# Altium schematic sheet EVB-ANNA-B5_SCHEM_0002_ANNA_Module.SchDoc: UBX_NORA_B1_SCHEM_0001_NORA_B1_Module
size A3; Date: 7/24/2020; CompanyName: U-blox; DrawnBy: EMOO; Engineer: EMOO; Organization: U-blox; Address1: 3950 Fairview Industrial Dr SE #100; Address2: Salem, OR 97302; DocumentNumber: 3; SheetNumber: 3; SheetTotal: 8; Website: www.u-blox.com; SheetSize: B
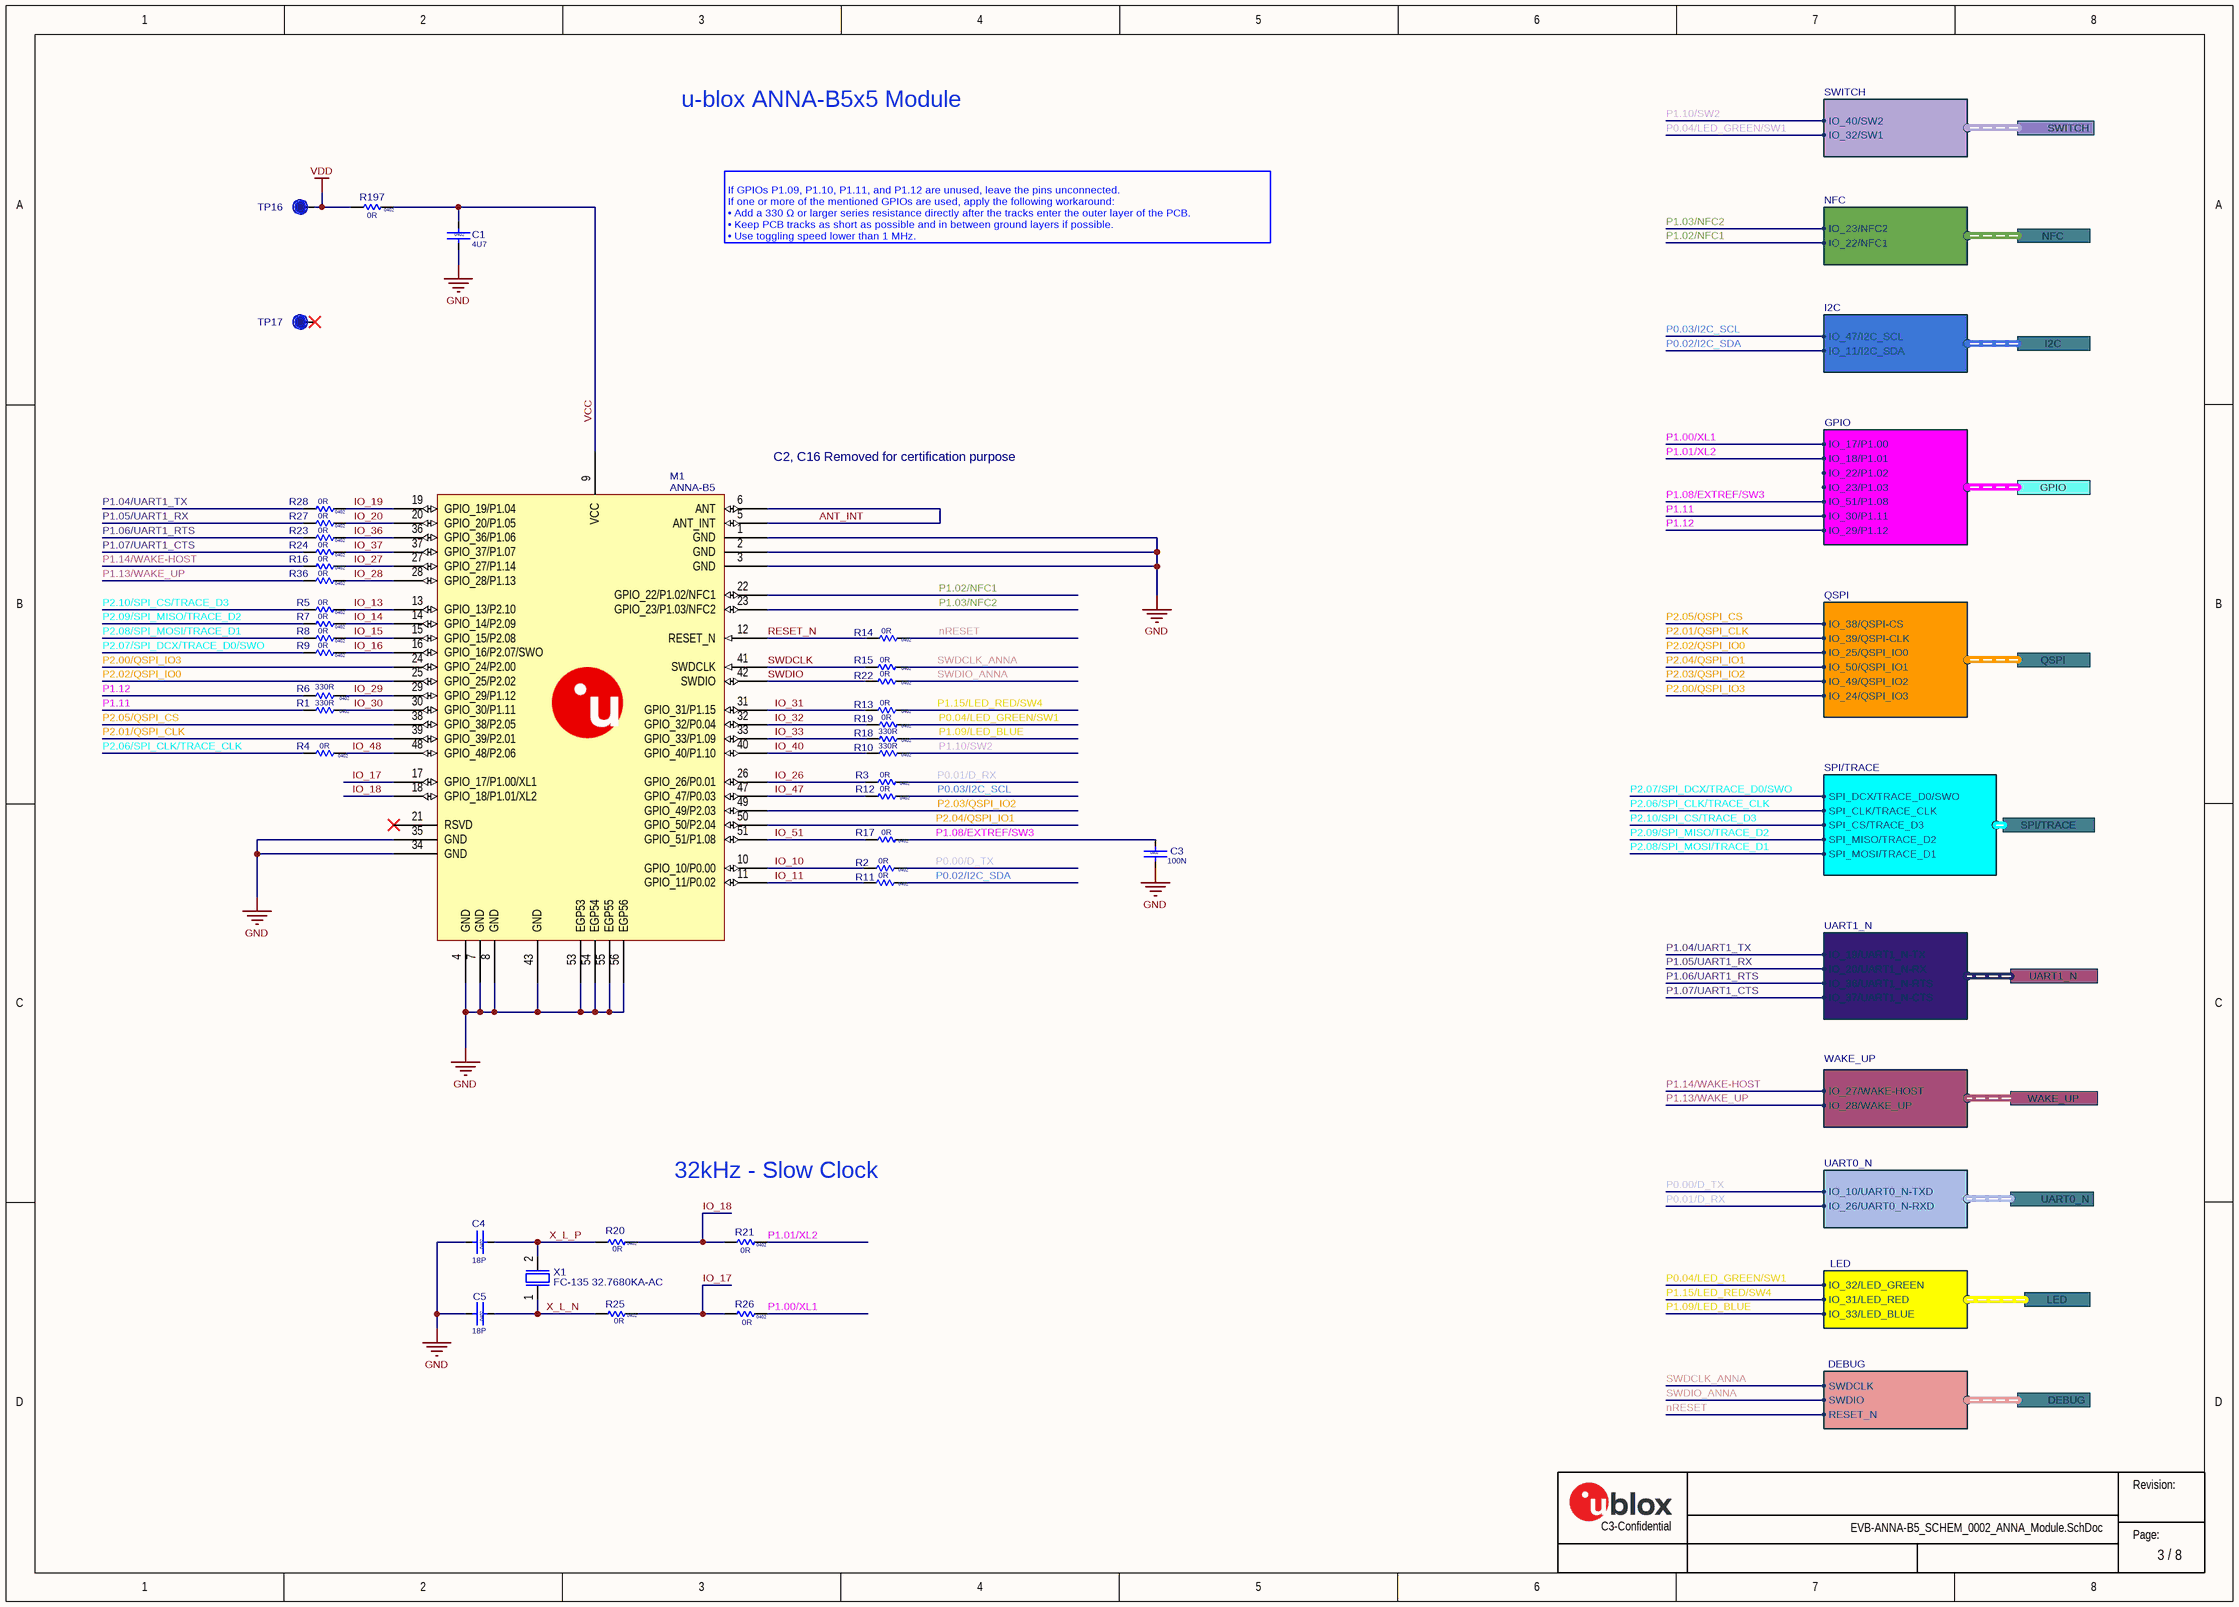
[diagram p0: EVB-ANNA-B5_SCHEM_0002_ANNA_Module.SchDoc]

## Parts
C1  value 4U7  Size: 0402  [Cap 0402 HD]  (hidden comment: UBXH01-0000243)
C3  value 100N  Size: 0402  [Cap 0402 HD]  (hidden comment: UBXH01-2021002)
C4  value 18P  Size: 0402  [Cap_0402_1100Lx600Wx600H_600x600Pad_350G_FLX]  (hidden comment: UBXH01-0004017)
C5  value 18P  Size: 0402  [Cap_0402_1100Lx600Wx600H_600x600Pad_350G_FLX]  (hidden comment: UBXH01-0004017)
M1  UBXH29-0000036  [ANNA-B5]  (value not drawn)
R1  value 330R  Size: 0402  [RES_0402_1100Lx600Wx400H_500x600Pad_400G_FLX]  (hidden comment: UBXH18-0008037)
R2  value 0R  Size: 0402  [RES 0402 HD]  (hidden comment: UBXH18-0003002)
R3  value 0R  Size: 0402  [RES 0402 HD]  (hidden comment: UBXH18-0003002)
R4  value 0R  Size: 0402  [RES 0402 HD]  (hidden comment: UBXH18-0003002)
R5  value 0R  Size: 0402  [RES 0402 HD]  (hidden comment: UBXH18-0003002)
R6  value 330R  Size: 0402  [RES_0402_1100Lx600Wx400H_500x600Pad_400G_FLX]  (hidden comment: UBXH18-0008037)
R7  value 0R  Size: 0402  [RES 0402 HD]  (hidden comment: UBXH18-0003002)
R8  value 0R  Size: 0402  [RES 0402 HD]  (hidden comment: UBXH18-0003002)
R9  value 0R  Size: 0402  [RES 0402 HD]  (hidden comment: UBXH18-0003002)
R10  value 330R  Size: 0402  [RES_0402_1100Lx600Wx400H_500x600Pad_400G_FLX]  (hidden comment: UBXH18-0008037)
R11  value 0R  Size: 0402  [RES 0402 HD]  (hidden comment: UBXH18-0003002)
R12  value 0R  Size: 0402  [RES_0402_1100Lx600Wx400H_500x600Pad_400G_FLX]  (hidden comment: UBXH18-0003002)
R13  value 0R  Size: 0402  [RES_0402_1100Lx600Wx400H_500x600Pad_400G_FLX]  (hidden comment: UBXH18-0003002)
R14  value 0R  Size: 0402  [RES_0402_1100Lx600Wx400H_500x600Pad_400G_FLX]  (hidden comment: UBXH18-0003002)
R15  value 0R  Size: 0402  [RES 0402 HD]  (hidden comment: UBXH18-0003002)
R16  value 0R  Size: 0402  [RES 0402 HD]  (hidden comment: UBXH18-0003002)
R17  value 0R  Size: 0402  [RES 0402 HD]  (hidden comment: UBXH18-0003002)
R18  value 330R  Size: 0402  [RES_0402_1100Lx600Wx400H_500x600Pad_400G_FLX]  (hidden comment: UBXH18-0008037)
R19  value 0R  Size: 0402  [RES 0402 HD]  (hidden comment: UBXH18-0003002)
R20  value 0R  Size: 0402  [RES 0402 HD]  (hidden comment: UBXH18-0003002)
R21  value 0R  Size: 0402  [RES_0402_1100Lx600Wx400H_500x600Pad_400G_FLX]  (hidden comment: UBXH18-0003002)
R22  value 0R  Size: 0402  [RES 0402 HD]  (hidden comment: UBXH18-0003002)
R23  value 0R  Size: 0402  [RES 0402 HD]  (hidden comment: UBXH18-0003002)
R24  value 0R  Size: 0402  [RES 0402 HD]  (hidden comment: UBXH18-0003002)
R25  value 0R  Size: 0402  [RES 0402 HD]  (hidden comment: UBXH18-0003002)
R26  value 0R  Size: 0402  [RES_0402_1100Lx600Wx400H_500x600Pad_400G_FLX]  (hidden comment: UBXH18-0003002)
R27  value 0R  Size: 0402  [RES 0402 HD]  (hidden comment: UBXH18-0003002)
R28  value 0R  Size: 0402  [RES 0402 HD]  (hidden comment: UBXH18-0003002)
R36  value 0R  Size: 0402  [RES_0402_1100Lx600Wx400H_500x600Pad_400G_FLX]  (hidden comment: UBXH18-0003002)
R197  value 0R  Size: 0402  [RES 0402 HD]  (hidden comment: UBXH18-0003002)
TP16  TP10R  [TP10R]  (value not drawn)  (no BOM)
TP17  TP10R  [TP10R]  (value not drawn)  (no BOM)
X1  Manufacturer P/N: FC-135 32.7680KA-AC  [XTAL_3215]  (hidden comment: UBXH21-0008104)

## Ports
DEBUG (harness Debug), GPIO (harness GPIO), I2C (harness I2C), LED (harness LED), NFC (harness NFC), QSPI (harness QSPI), SPI/TRACE (harness SPI/TRACE), SWITCH (harness SWITCH), UART0_N (harness UART0_N), UART1_N (harness UART1_N), WAKE_UP (harness WAKE_UP)

## Harnesses
DEBUG: RESET_N, SWDIO, SWDCLK
UART1_N: IO_36/UART1_N-RTS, IO_37/UART1_N-CTS, IO_19/UART1_N-TX, IO_20/UART1_N-RX
QSPI: IO_38/QSPI-CS, IO_39/QSPI-CLK, IO_25/QSPI_IO0, IO_50/QSPI_IO1, IO_49/QSPI_IO2, IO_24/QSPI_IO3
LED: IO_33/LED_BLUE, IO_31/LED_RED, IO_32/LED_GREEN
I2C: IO_47/I2C_SCL, IO_11/I2C_SDA
NFC: IO_23/NFC2, IO_22/NFC1
SWITCH: IO_40/SW2, IO_32/SW1
GPIO: IO_17/P1.00, IO_18/P1.01, IO_22/P1.02, IO_51/P1.08, IO_23/P1.03, IO_30/P1.11, IO_29/P1.12
UART0_N: IO_10/UART0_N-TXD, IO_26/UART0_N-RXD
WAKE_UP: IO_27/WAKE-HOST, IO_28/WAKE_UP
SPI/TRACE: SPI_DCX/TRACE_D0/SWO, SPI_CLK/TRACE_CLK, SPI_CS/TRACE_D3, SPI_MISO/TRACE_D2, SPI_MOSI/TRACE_D1

## Nets
GND: C1.2 C3.1 C4.2 C5.2 M1.1(GND) M1.2(GND) M1.3(GND) M1.4(GND) M1.7(GND) M1.8(GND) M1.34(GND) M1.35(GND) M1.43(GND) M1.53(EGP53) M1.54(EGP54) M1.55(EGP55) M1.56(EGP56)
VDD: R197.2 TP16.1
ANT_INT: M1.5(ANT_INT) M1.6(ANT)
IO_10: M1.10(GPIO_10/P0.00) R2.2
IO_11: M1.11(GPIO_11/P0.02) R11.1
IO_13: M1.13(GPIO_13/P2.10) R5.2
IO_14: M1.14(GPIO_14/P2.09) R7.2
IO_15: M1.15(GPIO_15/P2.08) R8.2
IO_16: M1.16(GPIO_16/P2.07/SWO) R9.2
IO_17: M1.17(GPIO_17/P1.00/XL1) R25.2 R26.2
IO_18: M1.18(GPIO_18/P1.01/XL2) R20.2 R21.2
IO_19: M1.19(GPIO_19/P1.04) R28.1
IO_20: M1.20(GPIO_20/P1.05) R27.1
IO_26: M1.26(GPIO_26/P0.01) R3.2
IO_27: M1.27(GPIO_27/P1.14) R16.2
IO_28: M1.28(GPIO_28/P1.13) R36.1
IO_29: M1.29(GPIO_29/P1.12) R6.2
IO_30: M1.30(GPIO_30/P1.11) R1.2
IO_31: M1.31(GPIO_31/P1.15) R13.1
IO_32: M1.32(GPIO_32/P0.04) R19.1
IO_33: M1.33(GPIO_33/P1.09) R18.2
IO_36: M1.36(GPIO_36/P1.06) R23.2
IO_37: M1.37(GPIO_37/P1.07) R24.2
IO_40: M1.40(GPIO_40/P1.10) R10.2
IO_47: M1.47(GPIO_47/P0.03) R12.1
IO_48: M1.48(GPIO_48/P2.06) R4.2
IO_51: M1.51(GPIO_51/P1.08) R17.2
nRESET: R14.2 ; port DEBUG.RESET_N
P0.00/D_TX: R2.1 ; port UART0_N.IO_10/UART0_N-TXD
P0.01/D_RX: R3.1 ; port UART0_N.IO_26/UART0_N-RXD
P0.02/I2C_SDA: R11.2 ; port I2C.IO_11/I2C_SDA
P0.03/I2C_SCL: R12.2 ; port I2C.IO_47/I2C_SCL
P0.04/LED_GREEN/SW1: R19.2 ; port LED.IO_32/LED_GREEN, port SWITCH.IO_32/SW1
P1.00/XL1: R26.1 ; port GPIO.IO_17/P1.00
P1.01/XL2: R21.1 ; port GPIO.IO_18/P1.01
P1.02/NFC1: M1.22(GPIO_22/P1.02/NFC1) ; port NFC.IO_22/NFC1
P1.03/NFC2: M1.23(GPIO_23/P1.03/NFC2) ; port NFC.IO_23/NFC2
P1.04/UART1_TX: R28.2 ; port UART1_N.IO_19/UART1_N-TX
P1.05/UART1_RX: R27.2 ; port UART1_N.IO_20/UART1_N-RX
P1.06/UART1_RTS: R23.1 ; port UART1_N.IO_36/UART1_N-RTS
P1.07/UART1_CTS: R24.1 ; port UART1_N.IO_37/UART1_N-CTS
P1.08/EXTREF/SW3: C3.2 R17.1 ; port GPIO.IO_51/P1.08
P1.09/LED_BLUE: R18.1 ; port LED.IO_33/LED_BLUE
P1.10/SW2: R10.1 ; port SWITCH.IO_40/SW2
P1.11: R1.1 ; port GPIO.IO_30/P1.11
P1.12: R6.1 ; port GPIO.IO_29/P1.12
P1.13/WAKE_UP: R36.2 ; port WAKE_UP.IO_28/WAKE_UP
P1.14/WAKE-HOST: R16.1 ; port WAKE_UP.IO_27/WAKE-HOST
P1.15/LED_RED/SW4: R13.2 ; port LED.IO_31/LED_RED
P2.00/QSPI_IO3: M1.24(GPIO_24/P2.00) ; port QSPI.IO_24/QSPI_IO3
P2.01/QSPI_CLK: M1.39(GPIO_39/P2.01) ; port QSPI.IO_39/QSPI-CLK
P2.02/QSPI_IO0: M1.25(GPIO_25/P2.02) ; port QSPI.IO_25/QSPI_IO0
P2.03/QSPI_IO2: M1.49(GPIO_49/P2.03) ; port QSPI.IO_49/QSPI_IO2
P2.04/QSPI_IO1: M1.50(GPIO_50/P2.04) ; port QSPI.IO_50/QSPI_IO1
P2.05/QSPI_CS: M1.38(GPIO_38/P2.05) ; port QSPI.IO_38/QSPI-CS
P2.06/SPI_CLK/TRACE_CLK: R4.1 ; port SPI/TRACE.SPI_CLK/TRACE_CLK
P2.07/SPI_DCX/TRACE_D0/SWO: R9.1 ; port SPI/TRACE.SPI_DCX/TRACE_D0/SWO
P2.08/SPI_MOSI/TRACE_D1: R8.1 ; port SPI/TRACE.SPI_MOSI/TRACE_D1
P2.09/SPI_MISO/TRACE_D2: R7.1 ; port SPI/TRACE.SPI_MISO/TRACE_D2
P2.10/SPI_CS/TRACE_D3: R5.1 ; port SPI/TRACE.SPI_CS/TRACE_D3
RESET_N: M1.12(RESET_N) R14.1
SWDCLK: M1.41(SWDCLK) R15.1
SWDCLK_ANNA: R15.2 ; port DEBUG.SWDCLK
SWDIO: M1.42(SWDIO) R22.1
SWDIO_ANNA: R22.2 ; port DEBUG.SWDIO
VCC: C1.1 M1.9(VCC) R197.1
X_L_N: C5.1 R25.1 X1.1
X_L_P: C4.1 R20.1 X1.2

Not connected (* = marked no-connect by the designer): M1 21(RSVD)*; TP17 1*

## Notes on the sheet
- u-blox ANNA-B5x5 Module
- If GPIOs P1.09, P1.10, P1.11, and P1.12 are unused, leave the pins unconnected.
  If one or more of the mentioned GPIOs are used, apply the following workaround:
  • Add a 330 Ω or larger series resistance directly after the tracks enter the outer layer of the PCB.
  • Keep PCB tracks as short as possible and in between ground layers if possible.
  • Use toggling speed lower than 1 MHz.
- (near M1) C2, C16 Removed for certification purpose
- 32kHz - Slow Clock
- Revision:
- C3-Confidential
- Page:

## Library data of the parts
C1 = UBXH01-0000243: CAP CER X5R 0402 4U7 20% 10V; Manufacturer: Murata Manufacturing Company, Ltd.; Manufacturer P/N: GRM155R61A475MEAA; Editor: martin.pilik; Released by: fabrice.bret-dibat; Env: GREEN; Permitted Use: Volume Products; Perferred: PREF; Mfg P/N Status: Active; Mfg P/N Split: 100; Mfg P/N Released: Yes; Part Number: UBXH01-0000243; Tolerance: 20%; Max Voltage: 10V; Min Operating Temp: -40°C; Max Operating Temp: 85°C; Part Type: Capacitor; Release Data: 2021-05-10 12:57:47.325652; UBX Wiki: https://wiki.u-blox.com/bin/view/Operations/PartDetails?index=24303; RefDes: C; Mfg P/N Datasheet: https://wiki.u-blox.com/bin/view/Generic/Docs/DocumentSummary?index=24302
C3 = UBXH01-2021002: CAP CER X5R 0402 100N 10% 10V; Manufacturer: Murata Manufacturing Company, Ltd.; Manufacturer P/N: GRM155R61A104KA01; Editor: roland.rust; Env: GREEN; Permitted Use: Volume Products; Perferred: PREF; Mfg P/N Status: NRND; Mfg P/N Split: 100; Mfg P/N Released: Yes; Part Number: UBXH01-2021002; Tolerance: 10%; Max Voltage: 10V; Part Type: Capacitor; Released by: roland.rust; Release Data: 2005-07-22T13:59:44; UBX Wiki: https://wiki.u-blox.com/bin/view/Operations/PartDetails?index=5759; RefDes: C; Manufacturer 2: Samsung Electro-Mechanics; Manufacturer P/N 2: CL05A104KP5NNN; Mfg P/N Status 2: Active; Mfg P/N Split 2: 0; Mfg P/N Released 2: Yes; Mfg P/N Datasheet 2: https://wiki.u-blox.com/bin/view/Generic/Docs/DocumentSummary?index=28113
C4 C5 = UBXH01-0004017: CAP CER C0G 0402 18P 5% 25V; Manufacturer: Murata Manufacturing Company, Ltd.; Manufacturer P/N: GRM1555C1H180JA01; Editor: doris.zahnd; Env: ROHS; Permitted Use: Volume Products; Perferred: PREF; Mfg P/N Status: NRND; Mfg P/N Split: 100; Mfg P/N Released: Yes; Released by: daniel.hurni; Part Number: UBXH01-0004017; Tolerance: 5%; Max Voltage: 25V; Min Operating Temp: -55°C; Max Operating Temp: 125°C; Part Type: Capacitor; UBX Wiki: https://wiki.u-blox.com/bin/view/Operations/PartDetails?index=5178; RefDes: C; Release Data: 2009-12-03T17:48:42; Manufacturer 2: Murata Manufacturing Company, Ltd.; Manufacturer P/N 2: GRM1555C1E180JZ01; Mfg P/N Status 2: Obsolete; Mfg P/N Split 2: 0; Mfg P/N Released 2: Yes; Manufacturer 3: Murata Manufacturing Company, Ltd.; Manufacturer P/N 3: GRM1555C1H180JZ01; Mfg P/N Status 3: Obsolete; Mfg P/N Split 3: 0; Mfg P/N Released 3: Yes
M1 = UBXH29-0000036: SHORT RANGE BLE AND IEEE802.15.4 SIP MODULE U-BLOX ANNA-B5; Part Description: SHORT RANGE BLE AND IEEE802.15.4 SIP U-BLOX ANNA-B5; Part Phase: Unreleased; Part Revision: 1; Environmental Grade: RoHS; Owner: Yaqin Chen; Use in new designs: Yes; RF Protocol: BLE 6.0 and IEEE802.15.4-2020; Core: Cortex®-M33; Flash Size: 1524 KB; RAM Size: 256 KB; RF Freq: 2.4GHz; Manufacturer: u-blox; Part Number: UBXH29-0000036; Automotive: No; ComponentLink1Description: Arena Link; ComponentLink1Url: https://app.bom.com/2K4NSGOQKM5DW9BJRRPB; Max Operating Temp: 85°C; Min Operating Temp: -40°C; Part Name: SHORT RANGE BLE AND IEEE802.15.4 SIP MODULE U-BLOX ANNA-B5; Part Status: Preferred; Part Type: Wireless Module; Volume Use: Yes; Mounting Type: SMT; Internal Antenna: Yes; Manufacturer P/N: ANNA-B5
R1 R6 R10 R18 = UBXH18-0008037: RES THICK FILM CHIP 0402 330R 5% 63mW; Manufacturer: KOA; Manufacturer P/N: RK73B1ETTP331J; Editor: daniel.hurni; Released by: doris.zahnd; Env: ROHS; Permitted Use: Volume Products; Perferred: PREF; Mfg P/N Status: Active; Mfg P/N Split: 100; Mfg P/N Released: Yes; Part Number: UBXH18-0008037; Tolerance: 5%; Max Power: 63mW; Part Type: Resistor; Release Data: 2009-12-01T17:14:36; UBX Wiki: https://wiki.u-blox.com/bin/view/Operations/PartDetails?index=6922; RefDes: R; Min Operating Temp: -55°C; Max Operating Temp: 125°C; Mfg P/N Datasheet: https://wiki.u-blox.com/bin/view/Generic/Docs/DocumentSummary?index=4543
  R1 R6: Case/Package: 0x0y
R2-R5 R7-R9 R11 R15-R17 R19 R22-R24 R27 R28 R197 = UBXH18-0003002: RES THICK FILM CHIP 0402 0R 0 100mW; Manufacturer: KOA; Manufacturer P/N: RK73Z1ETTP; Tolerance: 0; Editor: charlotte.biber; Released by: peter.mueller; Env: ROHS; Permitted Use: Volume Products; Perferred: PREF; Mfg P/N Status: NRND; Mfg P/N Split: 100; Mfg P/N Released: Yes; Part Number: UBXH18-0003002; Max Power: 100mW; Part Type: Resistor; Release Data: 2012-06-05 09:49:55.978616; UBX Wiki: https://wiki.u-blox.com/bin/view/Operations/PartDetails?index=6611; RefDes: R; Manufacturer 2: YAGEO; Manufacturer P/N 2: 2322_705_91001_L; Mfg P/N Status 2: NRND; Mfg P/N Split 2: 0; Mfg P/N Released 2: Yes
R12-R14 R20 R21 R25 R26 R36 = UBXH18-0003002: RES THICK FILM CHIP 0402 0R 0 100mW; Manufacturer: KOA; Manufacturer P/N: RK73Z1ETTD; Tolerance: 0; Editor: charlotte.biber; Released by: peter.mueller; Env: ROHS; Permitted Use: Volume Products; Perferred: PREF; Mfg P/N Status: NRND; Mfg P/N Split: 100; Mfg P/N Released: Yes; Part Number: UBXH18-0003002; Part Type: Resistor; UBX Wiki: https://wiki.u-blox.com/bin/view/Operations/PartDetails?index=6611; RefDes: R; Manufacturer 2: YAGEO; Manufacturer P/N 2: 2322_705_91001_L; Mfg P/N Split 2: 0; Mfg P/N Released 2: Yes; Max Power: 100mW
  R12-R14 R21 R26 R36: Release Data: 2012-06-05T09:49:55; Mfg P/N Status 2: Obsolete
  R20 R25: Release Data: 2012-06-05 09:49:55.978616; Mfg P/N Status 2: NRND
TP16 TP17 = TP10R: Testpoint, Round 1.0mm Dia; Added By: Jeremy D; Part Number: TP10R; Size: 1.0mm; Height: 0; DNP: DNP; Added Date: 2/1/2015; Checked By: Paul B; Checked Date: 2/5/2015
X1 = UBXH21-0008104: CRYSTAL CL=9PF EPSON FC-135 NI/SN TERMINATION 32.768KHz; Part Phase: Unreleased; Use in new designs: No; Environmental Grade: RoHS; Frequency Tolerance: 20PPM; Owner: Andreas Thiel; Volume Use: Yes; Part Number: UBXH21-0008104; Part Name: CRYSTAL CL=9PF EPSON FC-135 NI/SN TERMINATION; Automotive: No; ComponentLink1Description: Arena Link; ComponentLink1URL: https://app.bom.com/6O8RWKSUOQ9H0EE2EEBI; Frequency: 32.768KHz; Part Status: Non-Preferred; Part Type: Crystal